# Altium schematic sheet UnitB.SchDoc
size 297 x 209 mm
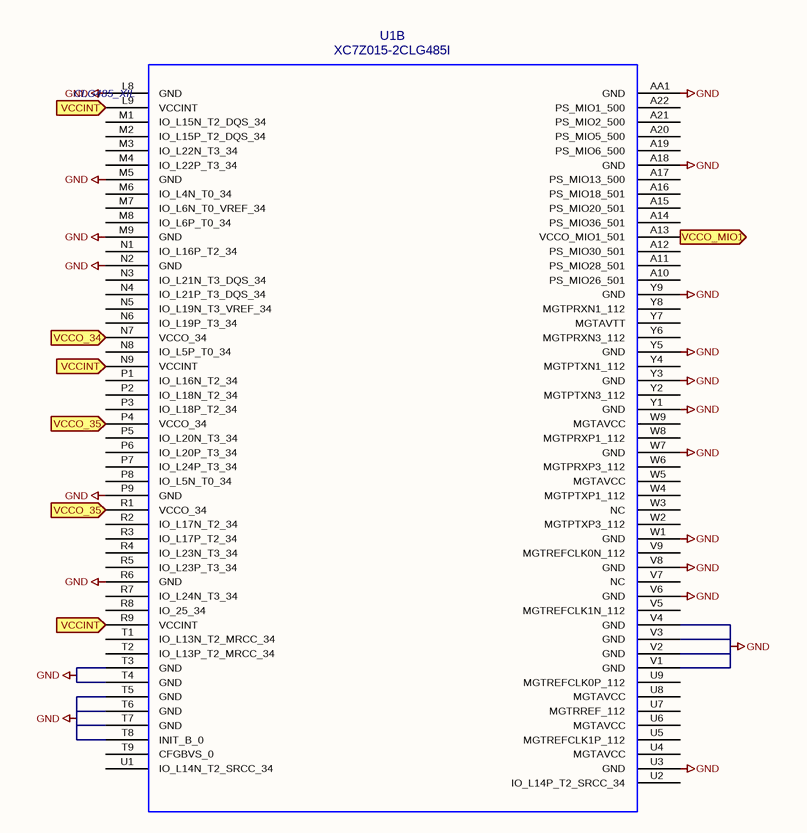
[diagram p0: UnitB.SchDoc]

## Parts
U1  XC7Z015-2CLG485I  [CLG485_XIL]  (part B of 5)

## Ports
VCCINT (in), VCCO_34 (in), VCCO_35 (in), VCCO_MIO1 (in)

## Nets
GND: U1.A18(GND) U1.AA1(GND) U1.L8(GND) U1.M5(GND) U1.M9(GND) U1.N2(GND) U1.P9(GND) U1.R6(GND) U1.T3(GND) U1.T4(GND) U1.T5(GND) U1.T6(GND) U1.T7(GND) U1.T8(INIT_B_0) U1.U3(GND) U1.V1(GND) U1.V2(GND) U1.V3(GND) U1.V4(GND) U1.V6(GND) U1.V8(GND) U1.W1(GND) U1.W7(GND) U1.Y1(GND) U1.Y3(GND) U1.Y5(GND) U1.Y9(GND)
VCCINT: U1.L9(VCCINT) U1.N9(VCCINT) U1.R9(VCCINT) ; port VCCINT
VCCO_34: U1.N7(VCCO_34) ; port VCCO_34
VCCO_35: U1.P4(VCCO_34) U1.R1(VCCO_34) ; port VCCO_35
VCCO_MIO1: U1.A13(VCCO_MIO1_501) ; port VCCO_MIO1

Not connected (* = marked no-connect by the designer): U1 A10(PS_MIO26_501) A11(PS_MIO28_501) A12(PS_MIO30_501) A14(PS_MIO36_501) A15(PS_MIO20_501) A16(PS_MIO18_501) A17(PS_MIO13_500) A19(PS_MIO6_500) A20(PS_MIO5_500) A21(PS_MIO2_500) A22(PS_MIO1_500) M1(IO_L15N_T2_DQS_34) M2(IO_L15P_T2_DQS_34) M3(IO_L22N_T3_34) M4(IO_L22P_T3_34) M6(IO_L4N_T0_34) M7(IO_L6N_T0_VREF_34) M8(IO_L6P_T0_34) N1(IO_L16P_T2_34) N3(IO_L21N_T3_DQS_34) N4(IO_L21P_T3_DQS_34) N5(IO_L19N_T3_VREF_34) N6(IO_L19P_T3_34) N8(IO_L5P_T0_34) P1(IO_L16N_T2_34) P2(IO_L18N_T2_34) P3(IO_L18P_T2_34) P5(IO_L20N_T3_34) P6(IO_L20P_T3_34) P7(IO_L24P_T3_34) P8(IO_L5N_T0_34) R2(IO_L17N_T2_34) R3(IO_L17P_T2_34) R4(IO_L23N_T3_34) R5(IO_L23P_T3_34) R7(IO_L24N_T3_34) R8(IO_25_34) T1(IO_L13N_T2_MRCC_34) T2(IO_L13P_T2_MRCC_34) T9(CFGBVS_0) U1(IO_L14N_T2_SRCC_34) U2(IO_L14P_T2_SRCC_34) U4(MGTAVCC) U5(MGTREFCLK1P_112) U6(MGTAVCC) U7(MGTRREF_112) U8(MGTAVCC) U9(MGTREFCLK0P_112) V5(MGTREFCLK1N_112) V7(NC) V9(MGTREFCLK0N_112) W2(MGTPTXP3_112) W3(NC) W4(MGTPTXP1_112) W5(MGTAVCC) W6(MGTPRXP3_112) W8(MGTPRXP1_112) W9(MGTAVCC) Y2(MGTPTXN3_112) Y4(MGTPTXN1_112) Y6(MGTPRXN3_112) Y7(MGTAVTT) Y8(MGTPRXN1_112)

## Notes on the sheet
- 1
- 2
- 3
- 4
- 5
- 6
- A
- B
- C
- D
- Title:
- File: UnitB.kicad_sch
- Sheet: /
- KiCad E.D.A.  kicad (5.1.4)-1
- Size: A4
- Date:
- Rev:
- Id: 1/1

## Library data of the parts
U1 = XC7Z015-2CLG485I: Value: XC7Z015-2CLG485I